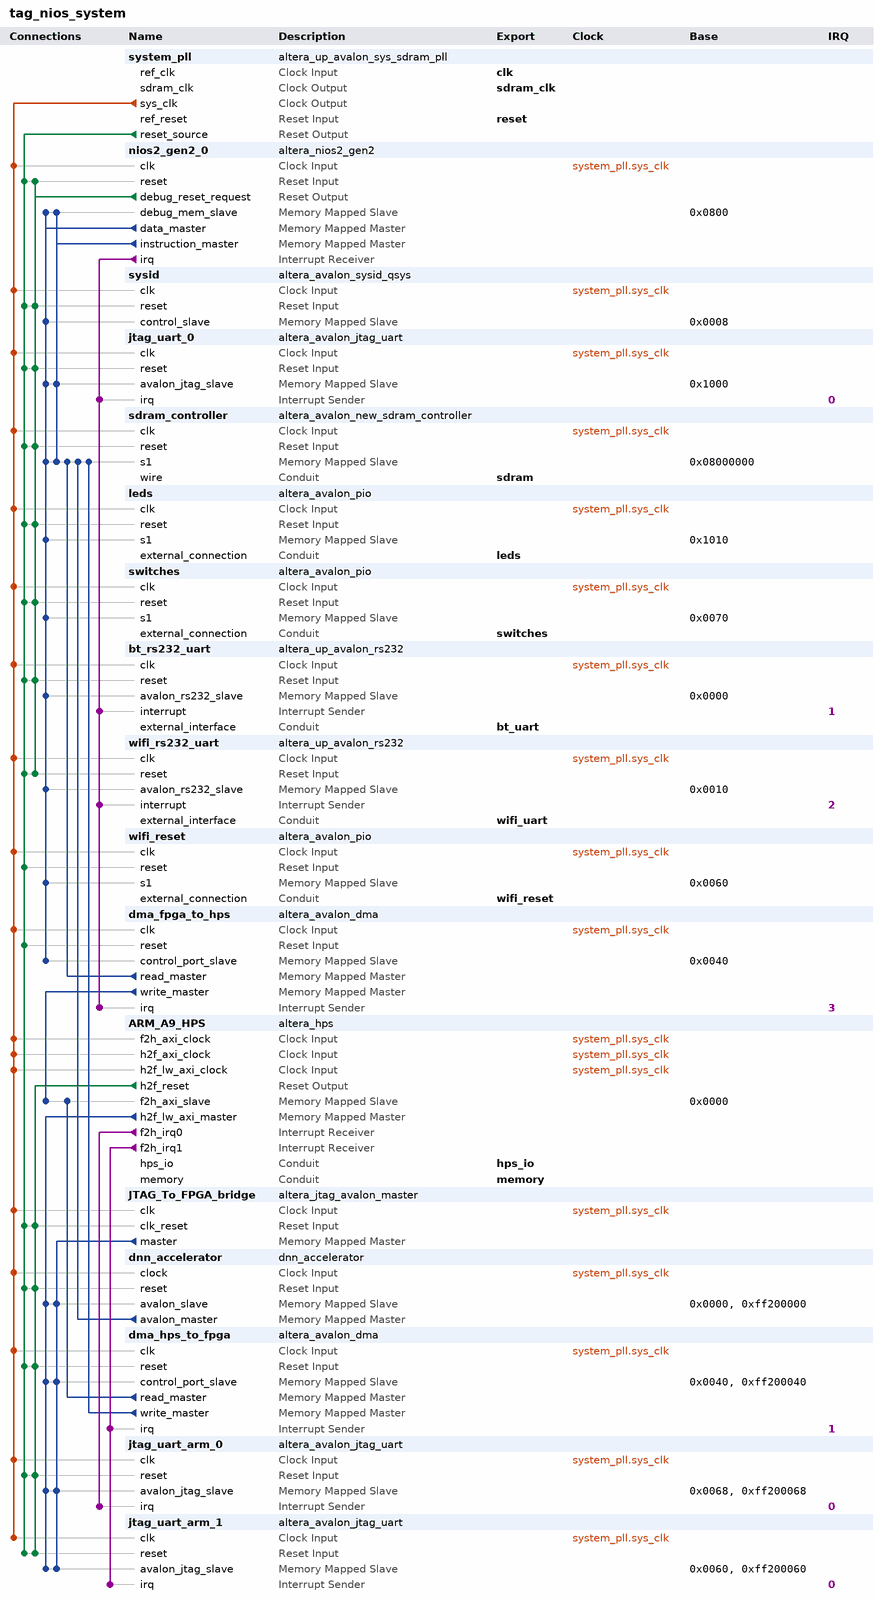
[diagram p0: system contents]
# Platform Designer (Qsys) system tag_nios_system, Cyclone V 5CSEMA5F31C6
# Parameters at their usual value, and those the tool derives, are not listed.
package require -exact qsys 15.0
create_system tag_nios_system
set_project_property DEVICE_FAMILY {Cyclone V}
set_project_property DEVICE 5CSEMA5F31C6

add_instance system_pll altera_up_avalon_sys_sdram_pll 15.0
set_instance_parameter_value system_pll CV_boards DE1-SoC
set_instance_parameter_value system_pll gui_outclk 50.0
set_instance_parameter_value system_pll gui_refclk 50.0

add_instance nios2_gen2_0 altera_nios2_gen2 15.0
set_instance_parameter_value nios2_gen2_0 dcache_size 2048
set_instance_parameter_value nios2_gen2_0 exceptionSlave sdram_controller.s1
set_instance_parameter_value nios2_gen2_0 icache_size 4096
set_instance_parameter_value nios2_gen2_0 impl Tiny
set_instance_parameter_value nios2_gen2_0 resetSlave sdram_controller.s1

add_instance sysid altera_avalon_sysid_qsys 15.0
set_instance_parameter_value sysid id 0

add_instance jtag_uart_0 altera_avalon_jtag_uart 15.0
set_instance_parameter_value jtag_uart_0 simInteractiveOptions NO_INTERACTIVE_WINDOWS

add_instance sdram_controller altera_avalon_new_sdram_controller 15.0
set_instance_parameter_value sdram_controller TAC 5.4
set_instance_parameter_value sdram_controller TRCD 15.0
set_instance_parameter_value sdram_controller TRP 15.0
set_instance_parameter_value sdram_controller casLatency 3
set_instance_parameter_value sdram_controller columnWidth 10
set_instance_parameter_value sdram_controller dataWidth 16
set_instance_parameter_value sdram_controller generateSimulationModel true
set_instance_parameter_value sdram_controller model single_Micron_MT48LC4M32B2_7_chip
set_instance_parameter_value sdram_controller numberOfBanks 4
set_instance_parameter_value sdram_controller numberOfChipSelects 1
set_instance_parameter_value sdram_controller powerUpDelay 100.0
set_instance_parameter_value sdram_controller refreshPeriod 7.8125
set_instance_parameter_value sdram_controller rowWidth 13

add_instance leds altera_avalon_pio 15.0
set_instance_parameter_value leds direction Output
set_instance_parameter_value leds width 10

add_instance switches altera_avalon_pio 15.0
set_instance_parameter_value switches direction Input
set_instance_parameter_value switches resetValue 127
set_instance_parameter_value switches width 10

add_instance bt_rs232_uart altera_up_avalon_rs232 15.0
set_instance_parameter_value bt_rs232_uart baud 115200
set_instance_parameter_value bt_rs232_uart parity None

add_instance wifi_rs232_uart altera_up_avalon_rs232 15.0
set_instance_parameter_value wifi_rs232_uart baud 115200
set_instance_parameter_value wifi_rs232_uart parity None

add_instance wifi_reset altera_avalon_pio 15.0
set_instance_parameter_value wifi_reset direction Output
set_instance_parameter_value wifi_reset resetValue 1
set_instance_parameter_value wifi_reset width 1

add_instance dma_fpga_to_hps altera_avalon_dma 15.0
set_instance_parameter_value dma_fpga_to_hps allowByteTransactions true
set_instance_parameter_value dma_fpga_to_hps allowDoubleWordTransactions true
set_instance_parameter_value dma_fpga_to_hps allowHalfWordTransactions true
set_instance_parameter_value dma_fpga_to_hps allowQuadWordTransactions true
set_instance_parameter_value dma_fpga_to_hps burstEnable false
set_instance_parameter_value dma_fpga_to_hps fifoDepth 32
set_instance_parameter_value dma_fpga_to_hps maxBurstSize 128
set_instance_parameter_value dma_fpga_to_hps minimumDmaTransactionRegisterWidth 16

add_instance ARM_A9_HPS altera_hps 15.0
set_instance_parameter_value ARM_A9_HPS EMAC1_Mode RGMII
set_instance_parameter_value ARM_A9_HPS EMAC1_PinMuxing {HPS I/O Set 0}
set_instance_parameter_value ARM_A9_HPS F2SCLK_COLDRST_Enable false
set_instance_parameter_value ARM_A9_HPS F2SCLK_DBGRST_Enable false
set_instance_parameter_value ARM_A9_HPS F2SCLK_WARMRST_Enable false
set_instance_parameter_value ARM_A9_HPS F2SINTERRUPT_Enable true
set_instance_parameter_value ARM_A9_HPS F2S_Width 2
set_instance_parameter_value ARM_A9_HPS FPGA_PERIPHERAL_OUTPUT_CLOCK_FREQ_EMAC0_GTX_CLK 100
set_instance_parameter_value ARM_A9_HPS FPGA_PERIPHERAL_OUTPUT_CLOCK_FREQ_EMAC0_MD_CLK 2.5
set_instance_parameter_value ARM_A9_HPS FPGA_PERIPHERAL_OUTPUT_CLOCK_FREQ_EMAC1_GTX_CLK 100
set_instance_parameter_value ARM_A9_HPS FPGA_PERIPHERAL_OUTPUT_CLOCK_FREQ_EMAC1_MD_CLK 2.5
set_instance_parameter_value ARM_A9_HPS HPS_PROTOCOL DDR3
set_instance_parameter_value ARM_A9_HPS I2C0_Mode I2C
set_instance_parameter_value ARM_A9_HPS I2C0_PinMuxing {HPS I/O Set 0}
set_instance_parameter_value ARM_A9_HPS I2C1_Mode I2C
set_instance_parameter_value ARM_A9_HPS I2C1_PinMuxing {HPS I/O Set 0}
set_instance_parameter_value ARM_A9_HPS LWH2F_Enable true
set_instance_parameter_value ARM_A9_HPS MEM_BANKADDR_WIDTH 3
set_instance_parameter_value ARM_A9_HPS MEM_CLK_FREQ 400.0
set_instance_parameter_value ARM_A9_HPS MEM_COL_ADDR_WIDTH 10
set_instance_parameter_value ARM_A9_HPS MEM_DQ_WIDTH 32
set_instance_parameter_value ARM_A9_HPS MEM_DRV_STR RZQ/7
set_instance_parameter_value ARM_A9_HPS MEM_ROW_ADDR_WIDTH 15
set_instance_parameter_value ARM_A9_HPS MEM_RTT_NOM RZQ/4
set_instance_parameter_value ARM_A9_HPS MEM_RTT_WR RZQ/4
set_instance_parameter_value ARM_A9_HPS MEM_TCL 11
set_instance_parameter_value ARM_A9_HPS MEM_TFAW_NS 30.0
set_instance_parameter_value ARM_A9_HPS MEM_TRAS_NS 35.0
set_instance_parameter_value ARM_A9_HPS MEM_TRCD_NS 13.75
set_instance_parameter_value ARM_A9_HPS MEM_TRFC_NS 260.0
set_instance_parameter_value ARM_A9_HPS MEM_TRP_NS 13.75
set_instance_parameter_value ARM_A9_HPS MEM_VENDOR JEDEC
set_instance_parameter_value ARM_A9_HPS MEM_WTCL 8
set_instance_parameter_value ARM_A9_HPS QSPI_Mode {1 SS}
set_instance_parameter_value ARM_A9_HPS QSPI_PinMuxing {HPS I/O Set 0}
set_instance_parameter_value ARM_A9_HPS REF_CLK_FREQ 25.0
set_instance_parameter_value ARM_A9_HPS S2F_Width 2
set_instance_parameter_value ARM_A9_HPS SDIO_Mode {4-bit Data}
set_instance_parameter_value ARM_A9_HPS SDIO_PinMuxing {HPS I/O Set 0}
set_instance_parameter_value ARM_A9_HPS SPIM1_Mode {Single Slave Select}
set_instance_parameter_value ARM_A9_HPS SPIM1_PinMuxing {HPS I/O Set 0}
set_instance_parameter_value ARM_A9_HPS STM_Enable false
set_instance_parameter_value ARM_A9_HPS TIMING_BOARD_AC_SKEW 0.02
set_instance_parameter_value ARM_A9_HPS TIMING_BOARD_AC_TO_CK_SKEW 0.01
set_instance_parameter_value ARM_A9_HPS TIMING_BOARD_DQ_TO_DQS_SKEW 0.05
set_instance_parameter_value ARM_A9_HPS TIMING_BOARD_MAX_CK_DELAY 0.03
set_instance_parameter_value ARM_A9_HPS TIMING_BOARD_MAX_DQS_DELAY 0.02
set_instance_parameter_value ARM_A9_HPS TIMING_BOARD_SKEW_BETWEEN_DQS 0.06
set_instance_parameter_value ARM_A9_HPS TIMING_BOARD_SKEW_CKDQS_DIMM_MAX 0.12
set_instance_parameter_value ARM_A9_HPS TIMING_BOARD_SKEW_CKDQS_DIMM_MIN 0.06
set_instance_parameter_value ARM_A9_HPS TIMING_BOARD_SKEW_WITHIN_DQS 0.01
set_instance_parameter_value ARM_A9_HPS TIMING_TDH 65
set_instance_parameter_value ARM_A9_HPS TIMING_TDQSCK 255
set_instance_parameter_value ARM_A9_HPS TIMING_TDQSQ 125
set_instance_parameter_value ARM_A9_HPS TIMING_TDS 30
set_instance_parameter_value ARM_A9_HPS TIMING_TIH 140
set_instance_parameter_value ARM_A9_HPS TIMING_TIS 180
set_instance_parameter_value ARM_A9_HPS TIMING_TQSH 0.4
set_instance_parameter_value ARM_A9_HPS UART0_Mode {No Flow Control}
set_instance_parameter_value ARM_A9_HPS UART0_PinMuxing {HPS I/O Set 0}
set_instance_parameter_value ARM_A9_HPS USB1_Mode SDR
set_instance_parameter_value ARM_A9_HPS USB1_PinMuxing {HPS I/O Set 0}
set_instance_parameter_value ARM_A9_HPS desired_cfg_clk_mhz 100.0
set_instance_parameter_value ARM_A9_HPS desired_qspi_clk_mhz 400.0

add_instance JTAG_To_FPGA_bridge altera_jtag_avalon_master 15.0

add_instance dnn_accelerator dnn_accelerator 1.0

add_instance dma_hps_to_fpga altera_avalon_dma 15.0
set_instance_parameter_value dma_hps_to_fpga allowByteTransactions true
set_instance_parameter_value dma_hps_to_fpga allowDoubleWordTransactions true
set_instance_parameter_value dma_hps_to_fpga allowHalfWordTransactions true
set_instance_parameter_value dma_hps_to_fpga allowQuadWordTransactions true
set_instance_parameter_value dma_hps_to_fpga burstEnable false
set_instance_parameter_value dma_hps_to_fpga fifoDepth 32
set_instance_parameter_value dma_hps_to_fpga maxBurstSize 128
set_instance_parameter_value dma_hps_to_fpga minimumDmaTransactionRegisterWidth 16

add_instance jtag_uart_arm_0 altera_avalon_jtag_uart 15.0
set_instance_parameter_value jtag_uart_arm_0 simInteractiveOptions NO_INTERACTIVE_WINDOWS

add_instance jtag_uart_arm_1 altera_avalon_jtag_uart 15.0
set_instance_parameter_value jtag_uart_arm_1 simInteractiveOptions NO_INTERACTIVE_WINDOWS

# connections
add_connection system_pll.sys_clk ARM_A9_HPS.f2h_axi_clock clock
add_connection system_pll.sys_clk ARM_A9_HPS.h2f_axi_clock clock
add_connection system_pll.sys_clk ARM_A9_HPS.h2f_lw_axi_clock clock
add_connection system_pll.sys_clk bt_rs232_uart.clk clock
add_connection system_pll.sys_clk dma_fpga_to_hps.clk clock
add_connection system_pll.sys_clk dma_hps_to_fpga.clk clock
add_connection system_pll.sys_clk dnn_accelerator.clock clock
add_connection system_pll.sys_clk JTAG_To_FPGA_bridge.clk clock
add_connection system_pll.sys_clk jtag_uart_0.clk clock
add_connection system_pll.sys_clk jtag_uart_arm_0.clk clock
add_connection system_pll.sys_clk jtag_uart_arm_1.clk clock
add_connection system_pll.sys_clk leds.clk clock
add_connection system_pll.sys_clk nios2_gen2_0.clk clock
add_connection system_pll.sys_clk sdram_controller.clk clock
add_connection system_pll.sys_clk switches.clk clock
add_connection system_pll.sys_clk sysid.clk clock
add_connection system_pll.sys_clk wifi_reset.clk clock
add_connection system_pll.sys_clk wifi_rs232_uart.clk clock
add_connection ARM_A9_HPS.h2f_reset dma_hps_to_fpga.reset reset
add_connection ARM_A9_HPS.h2f_reset dnn_accelerator.reset reset
add_connection ARM_A9_HPS.h2f_reset JTAG_To_FPGA_bridge.clk_reset reset
add_connection ARM_A9_HPS.h2f_reset jtag_uart_arm_0.reset reset
add_connection ARM_A9_HPS.h2f_reset jtag_uart_arm_1.reset reset
add_connection nios2_gen2_0.debug_reset_request bt_rs232_uart.reset reset
add_connection nios2_gen2_0.debug_reset_request jtag_uart_0.reset reset
add_connection nios2_gen2_0.debug_reset_request leds.reset reset
add_connection nios2_gen2_0.debug_reset_request nios2_gen2_0.reset reset
add_connection nios2_gen2_0.debug_reset_request sdram_controller.reset reset
add_connection nios2_gen2_0.debug_reset_request switches.reset reset
add_connection nios2_gen2_0.debug_reset_request sysid.reset reset
add_connection nios2_gen2_0.debug_reset_request wifi_rs232_uart.reset reset
add_connection system_pll.reset_source bt_rs232_uart.reset reset
add_connection system_pll.reset_source dma_fpga_to_hps.reset reset
add_connection system_pll.reset_source dma_hps_to_fpga.reset reset
add_connection system_pll.reset_source dnn_accelerator.reset reset
add_connection system_pll.reset_source JTAG_To_FPGA_bridge.clk_reset reset
add_connection system_pll.reset_source jtag_uart_0.reset reset
add_connection system_pll.reset_source jtag_uart_arm_0.reset reset
add_connection system_pll.reset_source jtag_uart_arm_1.reset reset
add_connection system_pll.reset_source leds.reset reset
add_connection system_pll.reset_source nios2_gen2_0.reset reset
add_connection system_pll.reset_source sdram_controller.reset reset
add_connection system_pll.reset_source switches.reset reset
add_connection system_pll.reset_source sysid.reset reset
add_connection system_pll.reset_source wifi_reset.reset reset
add_connection system_pll.reset_source wifi_rs232_uart.reset reset
add_connection ARM_A9_HPS.h2f_lw_axi_master dma_hps_to_fpga.control_port_slave avalon
set_connection_parameter_value ARM_A9_HPS.h2f_lw_axi_master/dma_hps_to_fpga.control_port_slave baseAddress 0x0040
add_connection ARM_A9_HPS.h2f_lw_axi_master dnn_accelerator.avalon_slave avalon
set_connection_parameter_value ARM_A9_HPS.h2f_lw_axi_master/dnn_accelerator.avalon_slave baseAddress 0x0000
add_connection ARM_A9_HPS.h2f_lw_axi_master jtag_uart_arm_0.avalon_jtag_slave avalon
set_connection_parameter_value ARM_A9_HPS.h2f_lw_axi_master/jtag_uart_arm_0.avalon_jtag_slave baseAddress 0x0068
add_connection ARM_A9_HPS.h2f_lw_axi_master jtag_uart_arm_1.avalon_jtag_slave avalon
set_connection_parameter_value ARM_A9_HPS.h2f_lw_axi_master/jtag_uart_arm_1.avalon_jtag_slave baseAddress 0x0060
add_connection dma_fpga_to_hps.read_master sdram_controller.s1 avalon
set_connection_parameter_value dma_fpga_to_hps.read_master/sdram_controller.s1 baseAddress 0x08000000
add_connection dma_fpga_to_hps.write_master ARM_A9_HPS.f2h_axi_slave avalon
set_connection_parameter_value dma_fpga_to_hps.write_master/ARM_A9_HPS.f2h_axi_slave baseAddress 0x0000
add_connection dma_hps_to_fpga.read_master ARM_A9_HPS.f2h_axi_slave avalon
set_connection_parameter_value dma_hps_to_fpga.read_master/ARM_A9_HPS.f2h_axi_slave baseAddress 0x0000
add_connection dma_hps_to_fpga.write_master sdram_controller.s1 avalon
set_connection_parameter_value dma_hps_to_fpga.write_master/sdram_controller.s1 baseAddress 0x08000000
add_connection dnn_accelerator.avalon_master sdram_controller.s1 avalon
set_connection_parameter_value dnn_accelerator.avalon_master/sdram_controller.s1 baseAddress 0x08000000
add_connection JTAG_To_FPGA_bridge.master dma_hps_to_fpga.control_port_slave avalon
set_connection_parameter_value JTAG_To_FPGA_bridge.master/dma_hps_to_fpga.control_port_slave baseAddress 0xff200040
add_connection JTAG_To_FPGA_bridge.master dnn_accelerator.avalon_slave avalon
set_connection_parameter_value JTAG_To_FPGA_bridge.master/dnn_accelerator.avalon_slave baseAddress 0xff200000
add_connection JTAG_To_FPGA_bridge.master jtag_uart_arm_0.avalon_jtag_slave avalon
set_connection_parameter_value JTAG_To_FPGA_bridge.master/jtag_uart_arm_0.avalon_jtag_slave baseAddress 0xff200068
add_connection JTAG_To_FPGA_bridge.master jtag_uart_arm_1.avalon_jtag_slave avalon
set_connection_parameter_value JTAG_To_FPGA_bridge.master/jtag_uart_arm_1.avalon_jtag_slave baseAddress 0xff200060
add_connection nios2_gen2_0.data_master bt_rs232_uart.avalon_rs232_slave avalon
set_connection_parameter_value nios2_gen2_0.data_master/bt_rs232_uart.avalon_rs232_slave baseAddress 0x0000
add_connection nios2_gen2_0.data_master dma_fpga_to_hps.control_port_slave avalon
set_connection_parameter_value nios2_gen2_0.data_master/dma_fpga_to_hps.control_port_slave baseAddress 0x0040
add_connection nios2_gen2_0.data_master jtag_uart_0.avalon_jtag_slave avalon
set_connection_parameter_value nios2_gen2_0.data_master/jtag_uart_0.avalon_jtag_slave baseAddress 0x1000
add_connection nios2_gen2_0.data_master leds.s1 avalon
set_connection_parameter_value nios2_gen2_0.data_master/leds.s1 baseAddress 0x1010
add_connection nios2_gen2_0.data_master nios2_gen2_0.debug_mem_slave avalon
set_connection_parameter_value nios2_gen2_0.data_master/nios2_gen2_0.debug_mem_slave baseAddress 0x0800
add_connection nios2_gen2_0.data_master sdram_controller.s1 avalon
set_connection_parameter_value nios2_gen2_0.data_master/sdram_controller.s1 baseAddress 0x08000000
add_connection nios2_gen2_0.data_master switches.s1 avalon
set_connection_parameter_value nios2_gen2_0.data_master/switches.s1 baseAddress 0x0070
add_connection nios2_gen2_0.data_master sysid.control_slave avalon
set_connection_parameter_value nios2_gen2_0.data_master/sysid.control_slave baseAddress 0x0008
add_connection nios2_gen2_0.data_master wifi_reset.s1 avalon
set_connection_parameter_value nios2_gen2_0.data_master/wifi_reset.s1 baseAddress 0x0060
add_connection nios2_gen2_0.data_master wifi_rs232_uart.avalon_rs232_slave avalon
set_connection_parameter_value nios2_gen2_0.data_master/wifi_rs232_uart.avalon_rs232_slave baseAddress 0x0010
add_connection nios2_gen2_0.instruction_master jtag_uart_0.avalon_jtag_slave avalon
set_connection_parameter_value nios2_gen2_0.instruction_master/jtag_uart_0.avalon_jtag_slave baseAddress 0x1000
add_connection nios2_gen2_0.instruction_master nios2_gen2_0.debug_mem_slave avalon
set_connection_parameter_value nios2_gen2_0.instruction_master/nios2_gen2_0.debug_mem_slave baseAddress 0x0800
add_connection nios2_gen2_0.instruction_master sdram_controller.s1 avalon
set_connection_parameter_value nios2_gen2_0.instruction_master/sdram_controller.s1 baseAddress 0x08000000
add_connection ARM_A9_HPS.f2h_irq0 jtag_uart_arm_0.irq interrupt
set_connection_parameter_value ARM_A9_HPS.f2h_irq0/jtag_uart_arm_0.irq irqNumber 0
add_connection ARM_A9_HPS.f2h_irq1 dma_hps_to_fpga.irq interrupt
set_connection_parameter_value ARM_A9_HPS.f2h_irq1/dma_hps_to_fpga.irq irqNumber 1
add_connection ARM_A9_HPS.f2h_irq1 jtag_uart_arm_1.irq interrupt
set_connection_parameter_value ARM_A9_HPS.f2h_irq1/jtag_uart_arm_1.irq irqNumber 0
add_connection nios2_gen2_0.irq bt_rs232_uart.interrupt interrupt
set_connection_parameter_value nios2_gen2_0.irq/bt_rs232_uart.interrupt irqNumber 1
add_connection nios2_gen2_0.irq dma_fpga_to_hps.irq interrupt
set_connection_parameter_value nios2_gen2_0.irq/dma_fpga_to_hps.irq irqNumber 3
add_connection nios2_gen2_0.irq jtag_uart_0.irq interrupt
set_connection_parameter_value nios2_gen2_0.irq/jtag_uart_0.irq irqNumber 0
add_connection nios2_gen2_0.irq wifi_rs232_uart.interrupt interrupt
set_connection_parameter_value nios2_gen2_0.irq/wifi_rs232_uart.interrupt irqNumber 2

# exported interfaces
add_interface bt_uart conduit end
set_interface_property bt_uart EXPORT_OF bt_rs232_uart.external_interface
add_interface clk clock sink
set_interface_property clk EXPORT_OF system_pll.ref_clk
add_interface hps_io conduit end
set_interface_property hps_io EXPORT_OF ARM_A9_HPS.hps_io
add_interface leds conduit end
set_interface_property leds EXPORT_OF leds.external_connection
add_interface memory conduit end
set_interface_property memory EXPORT_OF ARM_A9_HPS.memory
add_interface reset reset sink
set_interface_property reset EXPORT_OF system_pll.ref_reset
add_interface sdram conduit end
set_interface_property sdram EXPORT_OF sdram_controller.wire
add_interface sdram_clk clock source
set_interface_property sdram_clk EXPORT_OF system_pll.sdram_clk
add_interface switches conduit end
set_interface_property switches EXPORT_OF switches.external_connection
add_interface wifi_reset conduit end
set_interface_property wifi_reset EXPORT_OF wifi_reset.external_connection
add_interface wifi_uart conduit end
set_interface_property wifi_uart EXPORT_OF wifi_rs232_uart.external_interface

set_interconnect_requirement {$system} qsys_mm.clockCrossingAdapter HANDSHAKE
set_interconnect_requirement {$system} qsys_mm.enableEccProtection FALSE
set_interconnect_requirement {$system} qsys_mm.insertDefaultSlave FALSE
set_interconnect_requirement {$system} qsys_mm.maxAdditionalLatency 1

save_system tag_nios_system.qsys
